# Altium schematic sheet Main.SchDoc: PCB_LC_T_PI_RLC_TEST
size A4; Author: Ravi dusi; SheetNumber: 1; SheetTotal: 4
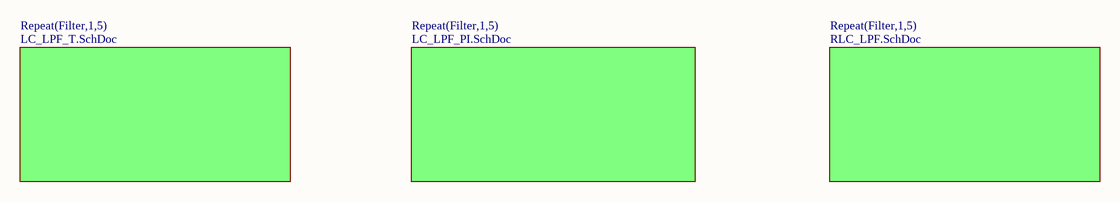
[diagram p0: Main.SchDoc]

## Sub-sheets
Repeat(Filter,1,5) = LC_LPF_T.SchDoc: no entries
Repeat(Filter,1,5) = LC_LPF_PI.SchDoc: no entries
Repeat(Filter,1,5) = RLC_LPF.SchDoc: no entries

## Notes on the sheet
- DOCUMENT NAME:
- TITLE:
- This document is created by Mitai. Any further questions can be asked through
- AUTHOR :
- REVIEWER:
- Sheet
- PART NO.:
- of
- *
- DATE:
- TEMPLATE:
- team@mitai.ai.
- A4
- Contact Address:Rosenheimer Straße 116b,81669, München.